# Altium schematic sheet Led Cape.SchDoc: Led Cape
size A4; Author: Luca Lucci; CompanyName: SpinItalia; Engineer: Luca Lucci; Organization: SpinItalia; ProjectName: Led Cape
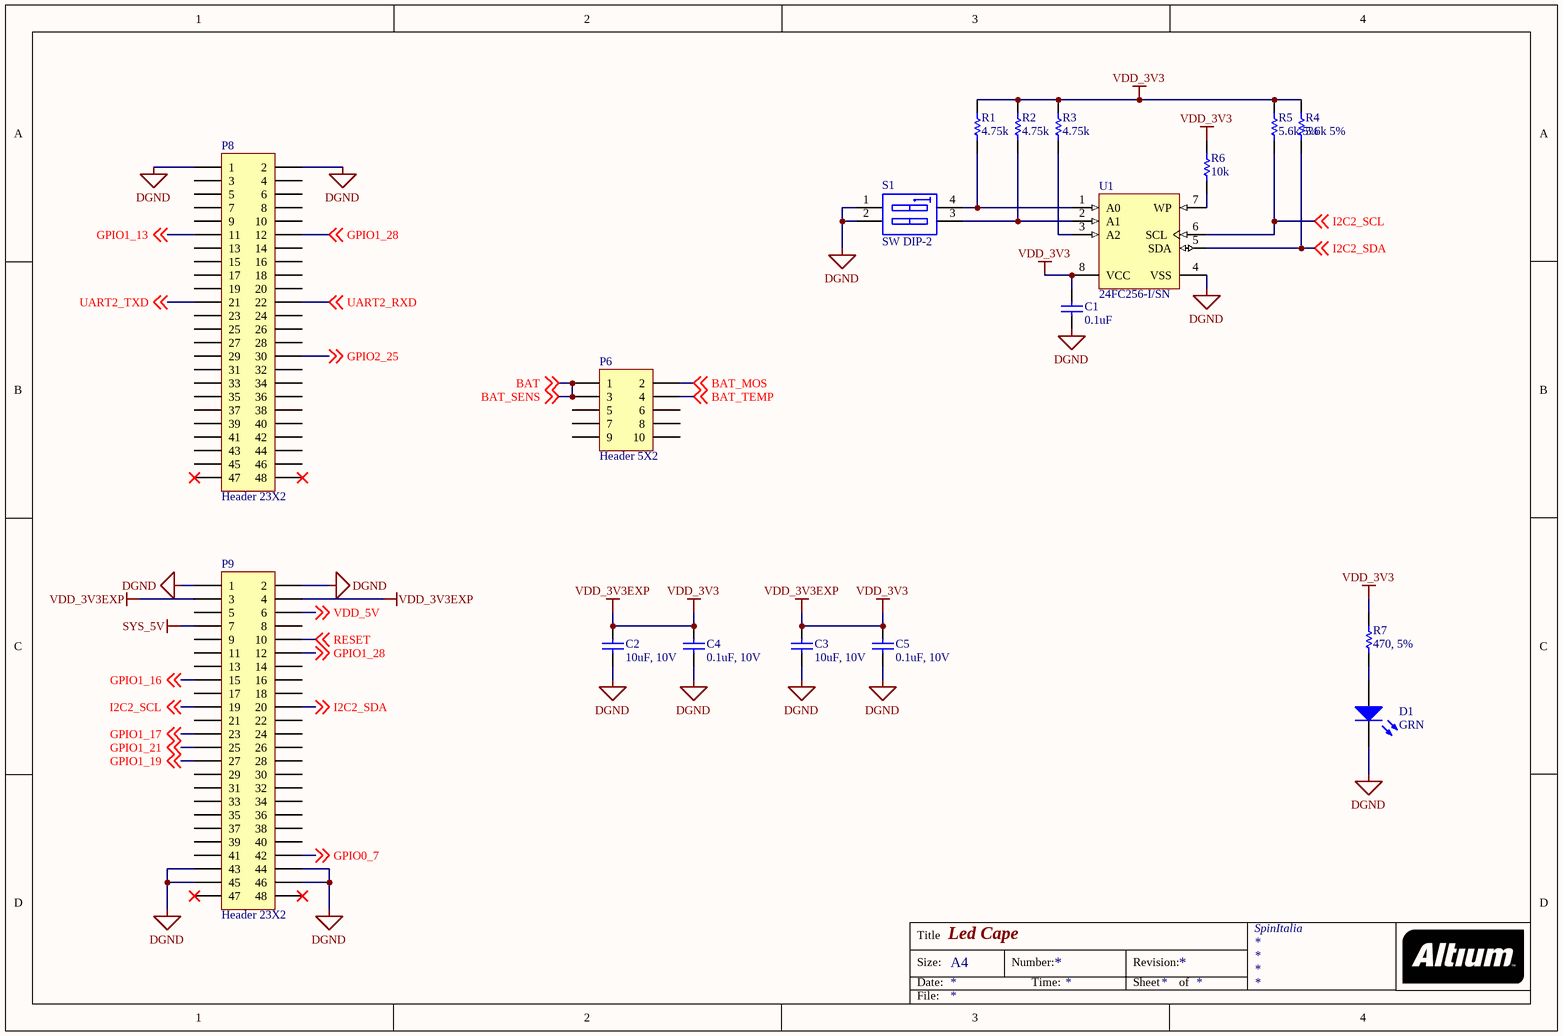
[diagram p0: Led Cape.SchDoc]

## Parts
C1  0.1uF  [1608[0603]]
C2  10uF, 10V  [1608[0603]]
C3  10uF, 10V  [1608[0603]]
C4  0.1uF, 10V  [1608[0603]]
C5  0.1uF, 10V  [1608[0603]]
D1  GRN  [3.5X2.8X1.9]
P6  Header 5X2  [HDR2X5]
P8  Header 23X2  [HDR2X24]
P9  Header 23X2  [HDR2X24]
R1  4.75k  [6-0805_N]
R2  4.75k  [6-0805_N]
R3  4.75k  [6-0805_N]
R4  5.6k 5%  [6-0805_N]
R5  5.6k 5%  [6-0805_N]
R6  10k  [6-0805_N]
R7  470, 5%  [6-0805_N]
S1  SW DIP-2  [DIP-4]
U1  24FC256-I/SN  [SOIC-SN8_N]

## Nets
DGND: C1.1 C2.1 C3.1 C4.1 C5.1 D1.2(K) P8.1 P8.2 P9.1 P9.2 P9.43 P9.44 P9.45 P9.46 S1.1(A1) S1.2(A2) U1.4(VSS)
SYS_5V: P9.7
VDD_3V3: C1.2 C2.2 C3.2 C4.2 C5.2 P9.3 P9.4 R1.1 R2.1 R3.1 R4.2 R5.2 R6.2 R7.2 U1.8(VCC)  [also labelled VDD_3V3EXP]
BAT: P6.1 P6.3 ; off-sheet BAT_SENS, off-sheet BAT  [also labelled BAT_SENS]
BAT_MOS: P6.2 ; off-sheet BAT_MOS
BAT_TEMP: P6.4 ; off-sheet BAT_TEMP
GPIO0_7: P9.42 ; off-sheet GPIO0_7
GPIO1_13: P8.11 ; off-sheet GPIO1_13
GPIO1_16: P9.15 ; off-sheet GPIO1_16
GPIO1_17: P9.23 ; off-sheet GPIO1_17
GPIO1_19: P9.27 ; off-sheet GPIO1_19
GPIO1_21: P9.25 ; off-sheet GPIO1_21
GPIO1_28: P8.12 P9.12 ; off-sheet GPIO1_28
GPIO2_25: P8.30 ; off-sheet GPIO2_25
I2C2_SCL: P9.19 R5.1 U1.6(SCL) ; off-sheet I2C2_SCL
I2C2_SDA: P9.20 R4.1 U1.5(SDA) ; off-sheet I2C2_SDA
RESET: P9.10 ; off-sheet RESET
UART2_RXD: P8.22 ; off-sheet UART2_RXD
UART2_TXD: P8.21 ; off-sheet UART2_TXD
VDD_5V: P9.6 ; off-sheet VDD_5V
NetD1_1: D1.1(A) R7.1
NetR1_2: R1.2 S1.4(B1) U1.1(A0)
NetR2_2: R2.2 S1.3(B2) U1.2(A1)
NetR3_2: R3.2 U1.3(A2)
NetR6_1: R6.1 U1.7(WP)

Not connected (* = marked no-connect by the designer): P6 5 6 7 8 9 10; P8 3 4 5 6 7 8 9 10 13 14 15 16 17 18 19 20 23 24 25 26 27 28 29 31 32 33 34 35 36 37 38 39 40 41 42 43 44 45 46 47* 48*; P9 5 8 9 11 13 14 16 17 18 21 22 24 26 28 29 30 31 32 33 34 35 36 37 38 39 40 41 47* 48*

## Notes on the sheet
- Title
- Size:
- Date:
- A4
- Number:
- Time:
- Revision:
- Sheet
- of
- File:

## Library data of the parts
C1-C5 = Cap: Capacitor; Value: 100pF; Published: 8-Jun-2000; LatestRevisionDate: 17-Jul-2002; LatestRevisionNote: Re-released for DXP Platform.; PackageReference: RAD-0.3; Publisher: Altium Limited; PackageDescription: Radial Cap, Thru-Hole; 2 Leads; 0.3 in Pin Spacing
D1 = LED3: Typical BLUE SiC LED; Published: 8-Jun-2000; LatestRevisionDate: 17-Dec-2003; LatestRevisionNote: PCB Footprint replaced.; DatasheetVersion: 16-Apr-2002; PackageVersion: 16-Apr-2002; PackageReference: 3.5X2.8X1.9; Publisher: Altium Limited; PackageDescription: SM LED; 2 C-Bend Leads; Body 3.5 x 2.8 x 1.9 mm, inc leads (LxWxH typ)
P6 = Header 5X2: Header, 5-Pin, Dual row; LatestRevisionDate: 17-Jul-2002; LatestRevisionNote: Re-released for DXP Platform.; Publisher: Altium Limited
P8 P9 = Header 24X2: Header, 23-Pin, Dual row; LatestRevisionDate: 17-Jul-2002; LatestRevisionNote: Re-released for DXP Platform.; Publisher: Altium Limited
R1-R7 = Res1: Resistor; Value: 1K; Published: 8-Jun-2000; LatestRevisionDate: 17-Jul-2002; LatestRevisionNote: Re-released for DXP Platform.; PackageReference: AXIAL-0.3; Publisher: Altium Limited; PackageDescription: Axial Device, Thru-Hole; 2 Leads; 0.3 in Pin Spacing
S1 = SW DIP-2: DIP Switch, 2 Position, SPST; Published: 24-Mar-1999; LatestRevisionDate: 17-Jul-2002; LatestRevisionNote: Re-released for DXP Platform.; PackageReference: DIP-4; Publisher: Altium Limited
U1 = 24FC256-I/SN: 256Kbit, 1MHz, 2.5V, I2C Serial EEPROM, 8-Pin SOIC 150mil, Industrial Temperature; Published: 29-Jan-2009; DatasheetVersion: revP, Oct-2007; PackageVersion: revBB, Aug-2009; PackageReference: SOIC-SN8; Publisher: Altium Limited; PackageDescription: 8-Lead Plastic Small Outline (SN) - Narrow, 3.90mm Body [SOIC]; Supplier 1: Digi-Key; Supplier Part Number 1: 24FC256-I/SN-ND; Supplier 2: Farnell; Supplier Part Number 2: 1579572; Code_JEDEC: MS-012; Code_IPC: SOIC127P600-8; ComponentLink1Description: Datasheet; ComponentLink1URL: http://ww1.microchip.com/downloads/en/DeviceDoc/21203P.pdf; ComponentLink2Description: Packaging Specification; ComponentLink2URL: http://www.microchip.com/stellent/groups/techpub_sg/documents/packagingspec/en012702.pdf; ComponentLink3Description: Microchip.com Home; ComponentLink3URL: http://www.microchip.com/